# Altium project Notecarrier AF.PrjPcb
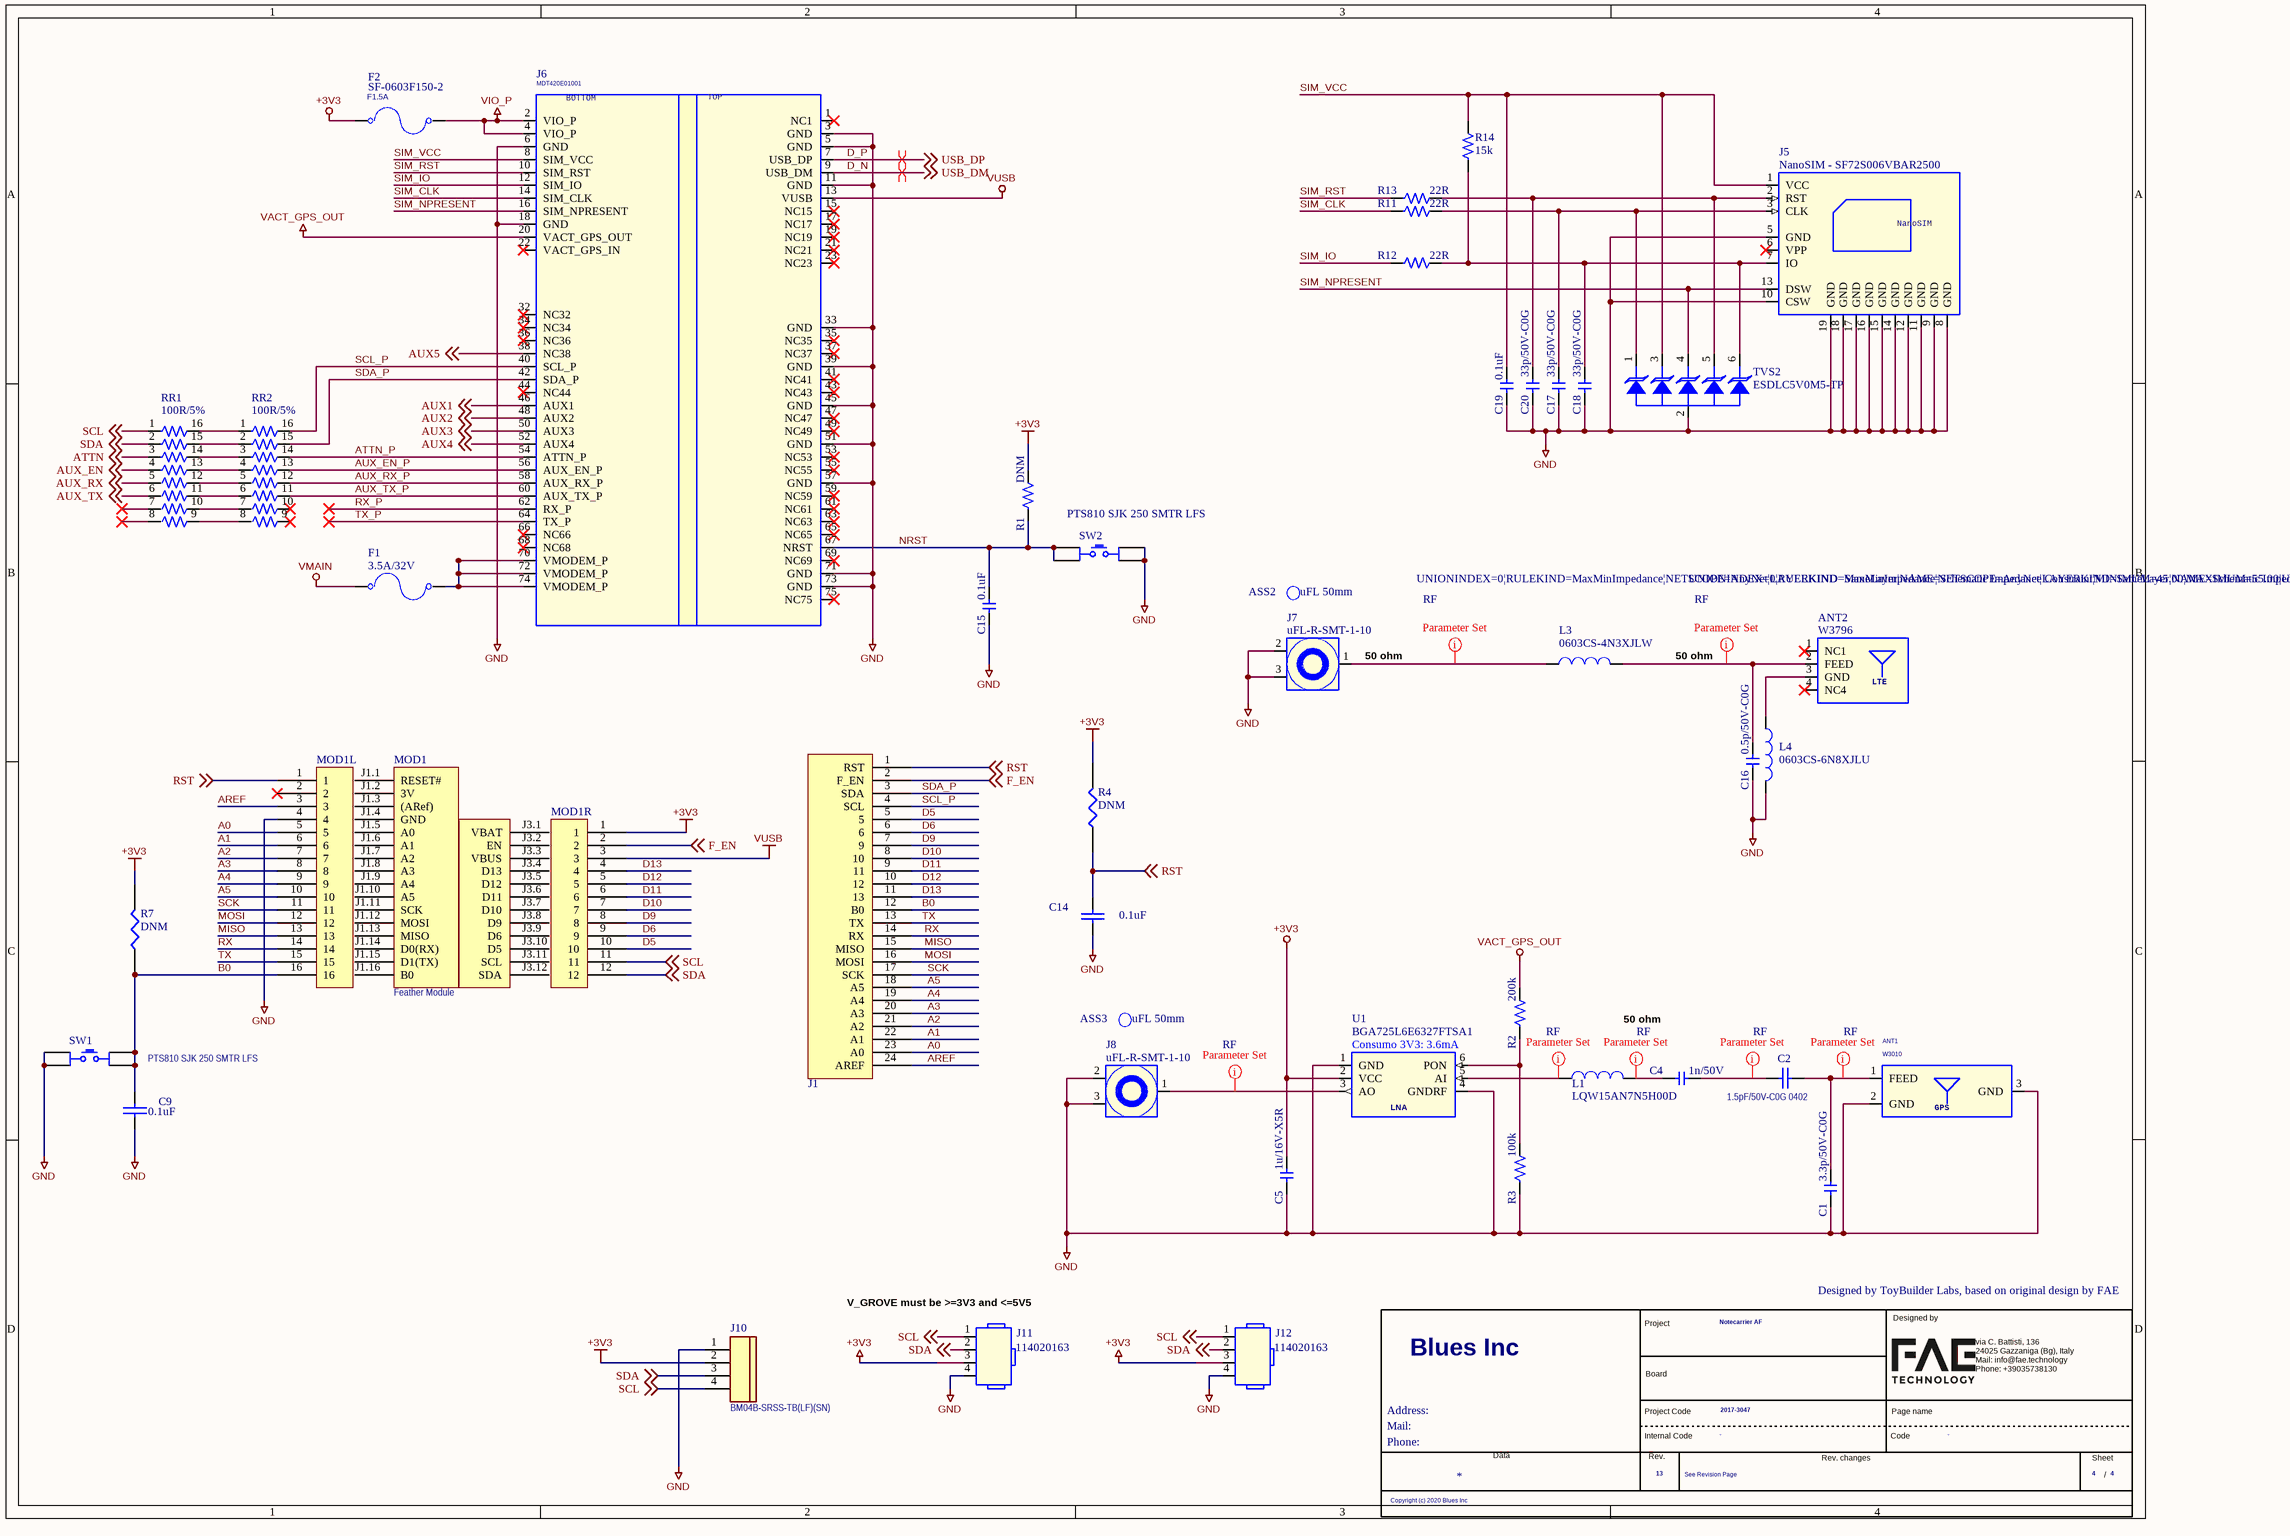
[diagram p0: 03 - CONNECTOR.SchDoc]
BoardRevision: V8; ProjectRevision: 1.7-v8
1 sheet, 48 parts. Net scope: global (net labels, ports and power ports of the same name join across sheets).
Board file: Notecarrier AF.PcbDoc

## Sheet 03 - CONNECTOR.SchDoc
size 420 x 297 mm; Organization: ToyBuilder Labs; Address1: 2736 E Walnut St; Address2: Pasadena, California 91107; Address4: +1 (626) 808-4010; DocumentNumber: 4; SheetNumber: 4; SheetTotal: 4

### Parts
*  Address: Address:  Copyright: Copyright (c) 2020 Blues Inc  CustomerName: Blues Inc  DocumentoRev: See Revision Page  Mail: Mail:  Nome Progetto: Notecarrier AF  Page Count: 4  Phone: Phone:  Project Code: 2017-3047  Revision: 13  (hidden comment: MyBlues)  (graphical)
ANT1  W3010  [ANT-W3010]
ANT2  W3796  [ANT-W3796]
ASS2  uFL 50mm  (mechanical)
ASS3  uFL 50mm  (mechanical)
C1  3.3p/50V-C0G  [CS-C-0402]
C2  1.5pF/50V-C0G 0402  [CAPC1005X55X25NL05T10]
C4  1n/50V  [CS-C-0402]
C5  1u/16V-X5R  [CS-C-0402]
C9  0.1uF  [CS-C-0402]
C14  0.1uF  [CS-C-0402]
C15  0.1uF  [CS-C-0402]
C16  0.5p/50V-C0G  [CS-C-0402]
C17  33p/50V-C0G  [CS-C-0402]
C18  33p/50V-C0G  [CS-C-0402]
C19  0.1uF  [CS-C-0402]
C20  33p/50V-C0G  [CS-C-0402]
F1  3.5A/32V  [FS-0603]
F2  SF-0603F150-2  [FS-0603]
J1  12X1  [WE24S - 2.54]  (value not drawn)  (no BOM)
J5  NanoSIM - SF72S006VBAR2500  [J-NANOSIM-SF72S006VBA]
J6  MDT420E01001  [J-75-0050-MOS-M2-E]
J7  uFL-R-SMT-1-10  [J-3-MDS-UFL]
J8  uFL-R-SMT-1-10  [J-3-MDS-UFL]
J10  BM04B-SRSS-TB(LF)(SN)  [JST_BM04B-SRSS-TB]
J11  114020163  [J-4-0200-MDS-GROVE]
J12  114020163  [J-4-0200-MDS-GROVE]
L1  LQW15AN7N5H00D  [LS-0402]
L3  0603CS-4N3XJLW  [LS-0603CS]
L4  0603CS-6N8XJLU  [LS-0603CS]
MOD1  Feather Module  [FEATHER_COMMON_MOUNTING]  (no BOM)
MOD1L  Socket 16-Pin, 0.100 inch (0.335 inch body)  [SOCKET_LFB_16]  (value not drawn)
MOD1R  Socket 12-Pin, 0.100 inch (0.335 inch body)  [SOCKET_LFB_12]  (value not drawn)
R1  DNM  [RS-0402]
R2  200k  [RS-0402]
R3  100k  [RS-0402]
R4  DNM  [RS-0402]
R7  DNM  [RS-0402]
R11  22R  [RS-0603]
R12  22R  [RS-0603]
R13  22R  [RS-0603]
R14  15k  [RS-0402]
RR1  100R/5%  [RR-8X-1506]
RR2  100R/5%  [RR-8X-1506]
SW1  PTS810 SJK 250 SMTR LFS  [CK-PTS810-SJx]
SW2  PTS810 SJK 250 SMTR LFS  [CK-PTS810-SJx]
TVS2  ESDLC5V0M5-TP  [SOT666]
U1  BGA725L6E6327FTSA1  Consumo: Consumo 3V3: 3.6mA  [XFDFN6]

### Nets
+3V3: C5.1 F2.1 J10.2 J11.3 J12.3 MOD1R.1 R1.2 R4.2 R7.2 U1.2(VCC)
GND: ANT1.2(GND) ANT1.3(GND) C1.2 C5.2 C9.2 C14.2 C15.2 C16.2 C17.2 C18.2 C19.2 C20.2 J5.5(GND) J5.8(GND) J5.9(GND) J5.10(CSW) J5.11(GND) J5.12(GND) J5.14(GND) J5.15(GND) J5.16(GND) J5.17(GND) J5.18(GND) J5.19(GND) J6.3(GND) J6.5(GND) J6.6(GND) J6.11(GND) J6.18(GND) J6.33(GND) J6.39(GND) J6.45(GND) J6.51(GND) J6.57(GND) J6.71(GND) J6.73(GND) J7.2 J7.3 J8.2 J8.3 J10.1 J11.4 J12.4 L4.2(A) MOD1L.4 R3.1 SW1.3 SW1.4 SW2.1 SW2.2 TVS2.2(A2) U1.1(GND) U1.4(GNDRF)
VACT_GPS_OUT: J6.20(VACT_GPS_OUT) R2.2
VIO_P: F2.2 J6.2(VIO_P) J6.4(VIO_P)
VMAIN: F1.1
VUSB: J6.13(VUSB) MOD1R.3
A0: J1.23(A0) MOD1L.5
A1: J1.22(A1) MOD1L.6
A2: J1.21(A2) MOD1L.7
A3: J1.20(A3) MOD1L.8
A4: J1.19(A4) MOD1L.9
A5: J1.18(A5) MOD1L.10
AREF: J1.24(AREF) MOD1L.3
ATTN: RR1.3 ; off-sheet ATTN
ATTN_P: J6.54(ATTN_P) RR2.14
AUX1: J6.46(AUX1) ; off-sheet AUX1
AUX2: J6.48(AUX2) ; off-sheet AUX2
AUX3: J6.50(AUX3) ; off-sheet AUX3
AUX4: J6.52(AUX4) ; off-sheet AUX4
AUX5: J6.38(NC38) ; off-sheet AUX5
AUX_EN: RR1.4 ; off-sheet AUX_EN
AUX_EN_P: J6.56(AUX_EN_P) RR2.13
AUX_RX: RR1.5 ; off-sheet AUX_RX
AUX_RX_P: J6.58(AUX_RX_P) RR2.12
AUX_TX: RR1.6 ; off-sheet AUX_TX
AUX_TX_P: J6.60(AUX_TX_P) RR2.11
B0: C9.1 J1.12(B0) MOD1L.16 R7.1 SW1.1 SW1.2
D5: J1.5 MOD1R.10
D6: J1.6 MOD1R.9
D9: J1.7(9) MOD1R.8
D10: J1.8(10) MOD1R.7
D11: J1.9(11) MOD1R.6
D12: J1.10(12) MOD1R.5
D13: J1.11(13) MOD1R.4
D_N: J6.9(USB_DM) ; off-sheet USB_DM  [also labelled USB_DM]
D_P: J6.7(USB_DP) ; off-sheet USB_DP  [also labelled USB_DP]
F_EN: J1.2(F_EN) MOD1R.2 ; off-sheet F_EN
MISO: J1.15(MISO) MOD1L.13
MOSI: J1.16(MOSI) MOD1L.12
NRST: C15.1 J6.67(NRST) R1.1 SW2.3 SW2.4
RST: C14.1 J1.1(RST) MOD1L.1 R4.1 ; off-sheet RST
RX: J1.14(RX) MOD1L.14
RX_P: J6.62(RX_P)
SCK: J1.17(SCK) MOD1L.11
SCL: J10.4 J11.1 J12.1 MOD1R.11 RR1.1 ; off-sheet SCL
SCL_P: J1.4(SCL) J6.40(SCL_P) RR2.16
SDA: J10.3 J11.2 J12.2 MOD1R.12 RR1.2 ; off-sheet SDA
SDA_P: J1.3(SDA) J6.42(SDA_P) RR2.15
SIM_CLK: J6.14(SIM_CLK) R11.1
SIM_IO: J6.12(SIM_IO) R12.1
SIM_NPRESENT: J5.13(DSW) J6.16(SIM_NPRESENT) TVS2.4(C4)
SIM_RST: J6.10(SIM_RST) R13.1
SIM_VCC: C19.1 J5.1(VCC) J6.8(SIM_VCC) R14.2 TVS2.3(C3)
TX: J1.13(TX) MOD1L.15
TX_P: J6.64(TX_P)
NetANT1_1: ANT1.1(FEED) C1.1 C2.2
NetANT2_2: ANT2.2(FEED) C16.1 L3.2(A)
NetANT2_3: ANT2.3(GND) L4.1(C)
NetC2_1: C2.1 C4.2
NetC4_1: C4.1 L1.2(A)
NetC17_1: C17.1 J5.3(CLK) R11.2 TVS2.1(C1)
NetC18_1: C18.1 J5.7(IO) R12.2 R14.1 TVS2.6(C6)
NetC20_1: C20.1 J5.2(RST) R13.2 TVS2.5(A5)
NetF1_2: F1.2 J6.70(VMODEM_P) J6.72(VMODEM_P) J6.74(VMODEM_P)
NetJ7_1: J7.1 L3.1(C)
NetJ8_1: J8.1 U1.3(AO)
NetL1_1: L1.1(C) U1.5(AI)
NetR2_1: R2.1 R3.2 U1.6(PON)
NetRR1_9: RR1.9 RR2.8
NetRR1_10: RR1.10 RR2.7
NetRR1_11: RR1.11 RR2.6
NetRR1_12: RR1.12 RR2.5
NetRR1_13: RR1.13 RR2.4
NetRR1_14: RR1.14 RR2.3
NetRR1_15: RR1.15 RR2.2
NetRR1_16: RR1.16 RR2.1

Not connected (* = marked no-connect by the designer): ANT2 1(NC1)* 4(NC4)*; J5 6(VPP)*; J6 1(NC1)* 15(NC15)* 17(NC17)* 19(NC19)* 21(NC21)* 22(VACT_GPS_IN)* 23(NC23)* 32(NC32)* 34(NC34)* 35(NC35)* 36(NC36)* 37(NC37)* 41(NC41)* 43(NC43)* 44(NC44)* 47(NC47)* 49(NC49)* 53(NC53)* 55(NC55)* 59(NC59)* 61(NC61)* 63(NC63)* 65(NC65)* 66(NC66)* 68(NC68)* 69(NC69)* 75(NC75)*; MOD1 J1.1(RESET#) J1.2(3V) J1.3((ARef)) J1.4(GND) J1.5(A0) J1.6(A1) J1.7(A2) J1.8(A3) J1.9(A4) J1.10(A5) J1.11(SCK) J1.12(MOSI) J1.13(MISO) J1.14(D0(RX)) J1.15(D1(TX)) J1.16(B0) J3.1(VBAT) J3.2(EN) J3.3(VBUS) J3.4(D13) J3.5(D12) J3.6(D11) J3.7(D10) J3.8(D9) J3.9(D6) J3.10(D5) J3.11(SCL) J3.12(SDA); MOD1L 2*; RR1 7* 8*; RR2 9* 10*

### Layout directives
differential pair: D_N, D_P
rule Impedance Constraint [Min = 45.00    Max = 55.00    ]; net class RF: NetANT1_1, NetANT2_2, NetC2_1, NetC4_1, NetJ7_1, NetJ8_1, NetL1_1

### Notes on the sheet
- (near J7) 50 ohm
- 50 ohm
- (near J11) V_GROVE must be >=3V3 and <=5V5
- Designed by ToyBuilder Labs, based on original design by FAE
- Title
- Size:
- Date:
- B
- Number:
- Time:
- Revision:
- Sheet
- of
- File:
- (in symbol AMPHENOL-75 - M-2 KEY E_13) BOTTOM; TOP
- (in symbol ANT - W3010 - GPS-GLONASS) GPS
- (in symbol MyBlues) Designed by; Project; Board; via C. Battisti, 136 / 24025 Gazzaniga (Bg), Italy / Mail: info@fae.technology / Phone: +39035738130; Project Code; Page name; Internal Code; Code; Data; Rev.; Rev. changes; Sheet; /
- (in symbol RAPIDO - SF-0603F150-2-1.5A/32V) F1.5A

### Library data of the parts
ANT1 = ANT - W3010 - GPS-GLONASS: ANTENNA CHIP 1.575GHZ D=3.2X10X2 W3010 PULSE SMT; Caratteristiche: 1.575GHz - GPS/GLONASS; Database: 43082; Famiglia: INDUTTORE; Modello: ANTENNA GPS; Pkg Type: SMD; Temp Range: -40°..+85°; Distributor: FAE; Price Distributor Cad: 0,53; MPN: W3010; PCB Footprint: ANT-W3010
ANT2 = ANT - W3796 - LTE: ANTENNA CHIP LTE D=40X7X3 W3796 PULSE SMT; Temp Range: -40°..+85°; Pkg Type: SMD; Note: 698MHz-960MHz - 1.427GHz-1.66GHz - 1.695GHz-2.2GHz - 2.3GHz-2.7GHz; Modello: ANTENNA LTE; Famiglia: INDUTTORE; Database: 43080; Price Distributor Cad: 2,1647; Distributor: FAE; Caratteristiche: LTE; PCB Footprint: ANT-W3796
ASS2 = 0000_BASE SIMBOLO_OBJ: CAVO COAX uFl-uFl 415-0086-050 HIROSE CINCH CONNECTIVITY SOLUTIONS JOHNSON; ROOM: LTE ANTENNA; Supplier 1: Digi-Key; Supplier Part Number 1: J932-ND
ASS3 = 0000_BASE SIMBOLO_OBJ: CAVO COAX uFl-uFl 415-0086-050 HIROSE CINCH CONNECTIVITY SOLUTIONS JOHNSON; ROOM: GPS ANTENNA
C1 = CS-C-0402-3.3p/50V-C0G: CHIP CAP.CER. 3.3pF 50V 5% C0G 0402; Database: 30030; Famiglia: CONDENSATORE; Modello: CERAMICO; Pkg Type: SMD; Temp Range: -55°..+125°; Caratteristiche: C0G; Distributor: FAE; Price Distributor Cad: 0,0013; PCB Footprint: CS-C-0402
C2 = CMP-2008-03820-1: Part Number: GJM1555C1H1R5BB01D; Manufacturer: Murata
C4 = CS-C-0402-1n/50V: CHIP CAP.CER. 1nF 50V 10% X7R 0402; Famiglia: CONDENSATORE; Modello: CERAMICO; Database: 33357; Pkg Type: SMD; Caratteristiche: X7R; Distributor: FAE; Price Distributor Cad: 0,0069; PCB Footprint: CS-C-0402
C5 = CS-C-0402-1u/16-X5R: CHIP CAP.CER. 1uF 16V 10% X5R 0402; Pkg Type: SMD; Modello: CERAMICO; Famiglia: CONDENSATORE; Database: 37485; Price Distributor Cad: 0,0253; Distributor: FAE; Caratteristiche: X5R; PCB Footprint: CS-C-0402
C9 = CAP: CHIP CAP.CER. 100nF 16V 10% X7R 0402; MFR: Yageo; D: Multilayer Ceramic Capacitors MLCC - SMD/SMT 0.1 uF 16V 10% Ceramic Capacitor; PN: CC0402KPX5R7BB104
C14 = CAP: CHIP CAP.CER. 100nF 16V 10% X7R 0402; MFR: Yageo; PN: CC0402KPX5R7BB104; D: Multilayer Ceramic Capacitors MLCC - SMD/SMT 0.1 uF 16V 10% Ceramic Capacitor
C15 C19 = CS-C-0402-100n/16V: CHIP CAP.CER. 100nF 16V 10% X7R 0402; MFR: Yageo; Database: 22452; Famiglia: CONDENSATORE; Modello: CERAMICO; Pkg Type: SMD; D: Multilayer Ceramic Capacitors MLCC - SMD/SMT 0.1 uF 16V 10% Ceramic Capacitor; PN: CC0402KPX5R7BB104; Caratteristiche: X7R; Distributor: FAE; Price Distributor Cad: 0,0021; PCB Footprint: CS-C-0402
C16 = CS-C-0402-0.5p/50V-C0G: CHIP CAP.CER. 0.5pF 50V ±0.25 C0G 0402 GRM1555C1HR50CA01D MURATA; Temp Range: -55°..+125°; Pkg Type: SMD; Modello: CERAMICO; Famiglia: CONDENSATORE; Price Distributor Cad: 0,08; Distributor: D-490-5959-1-ND; Caratteristiche: C0G; PCB Footprint: CS-C-0402
C17 C18 C20 = CS-C-0402-33p/50V-C0G: CHIP CAP.CER. 33pF 50V 5% C0G 0402; Database: 43360; Famiglia: CONDENSATORE; Modello: CERAMICO; Pkg Type: SMD; Caratteristiche: C0G; Distributor: FAE; Price Distributor Cad: 0,005; PCB Footprint: CS-C-0402
F1 = RAPIDO - 0603SFV350F- 3.5A/32V: FUSIBILE RAPIDO 3.5A 32V 0603 0603SFV350F/32-2 LITTELFUSE SMT; Temp Range: -55°..+125°; Pkg Type: SMD; Database: 40054; MPN: 0603SFV350F/32-2; Price Distributor Cad: 0,4034; Modello: RAPIDO; Famiglia: FUSIBILE; Distributor: FAE; Caratteristiche: 3.5A/32V; PCB Footprint: FS-0603
F2 = RAPIDO - SF-0603F150-2-1.5A/32V: FUSIBILE RAPIDO 1.5A 32V 0603 SF-0603F150-2 BOURNS SMT; Database: 32505; Pkg Type: SMD; Temp Range: -40°..+105°; Caratteristiche: 1.5A/32V; Distributor: FAE; Famiglia: FUSIBILE; Modello: RAPIDO; Price Distributor Cad: 0,1669; MPN: SF-0603F150-2; PCB Footprint: FS-0603
J1 = SIDECON: PN: DNM
J5 = NANOSIM - J-NANOSIM-SF72S006VBA: CONN. NANOSIM 8P F/90° PUSH-PUSH SF72S006VBAR2500 JAE ELECTRONICS SMT; Pkg Type: SMD; Temp Range: -25°..+85°; Database: 41049; Famiglia: CONNETTORE; ROOM: NANO-SIM; Distributor: FAE; Price Distributor Cad: 0,7362; Modello: NanoSIM; PCB Footprint: J-NANOSIM-SF72S006VBA
J6 = AMPHENOL-75 - M-2 KEY E_13: CONN. M.2 75P M/90° P=0.5 MDT420E01001 AMPHENOL SMT; Famiglia: CONNETTORE; Pkg Type: SMD; Temp Range: -40°..+80°; ROOM: M2 CONNECTOR; Caratteristiche: 75P; Distributor: D-MDT420E01001CT-ND; Price Distributor Cad: 1,21; PCB Footprint: J-75-0050-MOS-M2-E
J7 J8 = UFL - U-FL-R-SMT-1-10: CONN. RF M U.FL-R-SMT-1(10) HIROSE SMT; Pkg Type: SMD; Temp Range: -40°..+90°; Database: 28096; Famiglia: CONNETTORE; Note: 50ohm; Modello: UFL; Distributor: FAE; Price Distributor Cad: 0,115; Caratteristiche: RF; PCB Footprint: J-3-MDS-UFL
J10 = JST_BM04B-SRSS-TB: Wire-to-board, 1mm, SMT Vert, 4POS; Manufacturer: JST; Description 1: CONN HEADER SMD 4POS 1MM; Connector Type: Male Pin; Current Rating: 1A; Contact Resistance: 40mR; Supplier 1: Arrow Electronics; Supplier Part Number 1: BM04B-SRSS-TB (LF)(SN); Manufacturer Part Number: BM04B-SRSS-TB(LF)(SN); Contact Plating: Tin,Lead,Copper; Contact Material: Copper Alloy; Depth: 2.9mm; ComponentLink1URL: https://datasheet.ciiva.com/26894/getdatasheetpartid-690899-26894827.pdf?src-supplier=Verical; ComponentLink1Description: https://datasheet.ciiva.com/26894/getdatasheetpartid-690899-26894827.pdf?src-supplier=Verical; ComponentLink2URL: https://datasheet.ciiva.com/26924/getdatasheetpartid-708793-26924043.pdf?src-supplier=Verical; ComponentLink2Description: https://datasheet.ciiva.com/26924/getdatasheetpartid-708793-26924043.pdf?src-supplier=Verical; ComponentLink3URL: https://datasheet.ciiva.com/16211/esr-16211085.pdf?src-supplier=Future+Electronics; ComponentLink3Description: https://datasheet.ciiva.com/16211/esr-16211085.pdf?src-supplier=Future+Electronics
J11 J12 = GROVE - J-4-0200-MDS-GROVE: CONN. GROVE 4P M/D P=2 114020163 SEEDSTUDIO SMT; Famiglia: CONNETTORE; Pkg Type: SMD; Caratteristiche: 4P; Distributor: D-1597-114020163-ND; MPN: 114020163; Modello: GROVE; Price Distributor Cad: 0,1345; PCB Footprint: J-4-0200-MDS-GROVE
L1 = L - LQW15AN7N5H00D - 7.5n/0.57A: INDUTTANZA 7.5nH 0.57A 3% A FILO 0402 LQW15AN7N5H00D MURATA SMT; Caratteristiche: 570mA; Database: 43079; Famiglia: INDUTTORE; Note: Non Schermato - 6GHz; Pkg Type: SMD; Temp Range: -55°..+125°; Distributor: FAE; Modello: INDUTTANZA; Price Distributor Cad: 0,1005; PCB Footprint: LS-0402
L3 = L - 0603CS-4N3XJLW-4.3n/0.7A: INDUTTANZA 4.3nH 0.7A 5% 0603 0603CS-4N3XJLW COILCRAFT SMT; Caratteristiche: 700mA; Famiglia: INDUTTORE; Modello: INDUTTANZA RF; Note: 5.9GHz; Pkg Type: SMD; Temp Range: -40°..+125°; Distributor: M-994-0603CS-4N3XJLW; MPN: 0603CS-4N3XJLW; Price Distributor Cad: 0,766; PCB Footprint: LS-0603CS
L4 = L - 0603CS-6N8XJLU-6.8n/0.7A: INDUTTANZA 6.8nH 0.7A 5% 0603 0603CS-6N8XJLU COILCRAFT SMT; Temp Range: -40°..+125°; Pkg Type: SMD; Note: 5.9GHz; Modello: INDUTTANZA RF; Famiglia: INDUTTORE; Database: 43078; Caratteristiche: 700mA; Price Distributor Cad: 0,54; Distributor: FAE; PCB Footprint: LS-0603CS
MOD1 = FEATHER_COMMON_MOUNTING: Socket Footprint for Typical Adafruit Feather Module, SMT socket type
MOD1L = SOCKET_LFB_16: Socket 16-Pin, 0.100 in
MOD1R = SOCKET_LFB_12: Socket 12-Pin, 0.100 in
R1 = RS-0402-1k: CHIP RES. 1K 0402 1/16W 1%; Temp Range: -55°..+155°; Pkg Type: SMD; Modello: FISSO; Famiglia: RESISTENZA; Database: 25126; Price Distributor Cad: 0,0005; Distributor: FAE; Caratteristiche: 1%; PCB Footprint: RS-0402
R2 = RS-0402-200k: CHIP RES. 200K 0402 1/16W 1%; Pkg Type: SMD; Modello: FISSO; Famiglia: RESISTENZA; Database: 27068; Price Distributor Cad: 0,0006; Distributor: FAE; Caratteristiche: 1%; PCB Footprint: RS-0402
R3 = RS-0402-100k: CHIP RES. 100K 0402 1/16W 1%; Database: 25127; Pkg Type: SMD; Famiglia: RESISTENZA; Modello: FISSO; Price Distributor Cad: 0,0004; Distributor: FAE; Caratteristiche: 1%; PCB Footprint: RS-0402
R4 R7 = R1_S: SMD Resistors; PN: DNM
R11-R13 = RS-0603-22r: CHIP RES. 22R 0603 1/16W 1%; Modello: FISSO; Famiglia: RESISTENZA; Database: 20385; Pkg Type: SMD; Caratteristiche: 1%; Price Distributor Cad: 0,0005; Distributor: FAE; PCB Footprint: RS-0603
R14 = RS-0402-15k: CHIP RES. 15K 0402 1/16W 1%; Modello: FISSO; Famiglia: RESISTENZA; Pkg Type: SMD; Temp Range: -55°..+155°; Database: 40387; Caratteristiche: 1%; Distributor: FAE; Price Distributor Cad: 0,0004; PCB Footprint: RS-0402
RR1 RR2 = RR-8X-1506-100r/5%: RETE RESISTIVA 8R sing. 100R 5% 1506 CONVEX CAY16-101J8LF BOURNS SMT; Temp Range: -55°..+125°; Pkg Type: SMD; Note: 200ppm; Famiglia: RESISTENZA; Database: 40062; Caratteristiche: 8X; Price Distributor Cad: 0,0361; Modello: RETE; Distributor: FAE; PCB Footprint: RR-8X-1506
SW1 SW2 = CK_PTS810 SJK 250 SMTR LFS: SWITCH TACTILE SPST-NO 0.05A 12V 4.2 mm x 3.2 mm; Manufacturer: C&K; Supplier 1: Digi-Key; Manufacturer Part Number: PTS810 SJK 250 SMTR LFS; ComponentLink1URL: https://www.ckswitches.com/media/1476/pts810.pdf; ComponentLink1Description: https://www.ckswitches.com/media/1476/pts810.pdf; Supplier Part Number 1: CKN10503CT-ND
TVS2 = TVS-UNI5x - ESDLC5V0M5-TP - 5V: DIODO TVS TRANSIL UNIDIR. 20W 5V ESDLC5V0M5-TP SOT563 SMT; Temp Range: -65°..+150°; Pkg Type: SMD; Note: Cmax=10pF - SIM; Famiglia: PROTEZIONE; Database: 44643; Caratteristiche: 1.6A/5V/20W; Price Distributor Cad: 0,37; Modello: TVS; Distributor: FAE; PCB Footprint: SOT666
U1 = LNA-RF - BGA725L6E6327FTSA1: INTEGRATO BGA725L6E6327FTSA1 INFINEON TSLP-6 SMT; Temp Range: -40°..+125°; Pkg Type: SMD; Note: VCC=1.5V - 3.6V; Modello: LNA; Database: 43081; Caratteristiche: RF; ROOM: GPS ANTENNA; Price Distributor Cad: 0,2054; Famiglia: INTEGRATO; Distributor: FAE; PCB Footprint: XFDFN6
* = MyBlues: Customer Code: -; Database: -; Page Number: 4; Page Modify Date: *; Customer name: Blues Inc; FAE RD code: 2017-3047

## Assembly variants
Standard Build: not fitted FID1 FID2 MOD1 R6 R9 R10 R16